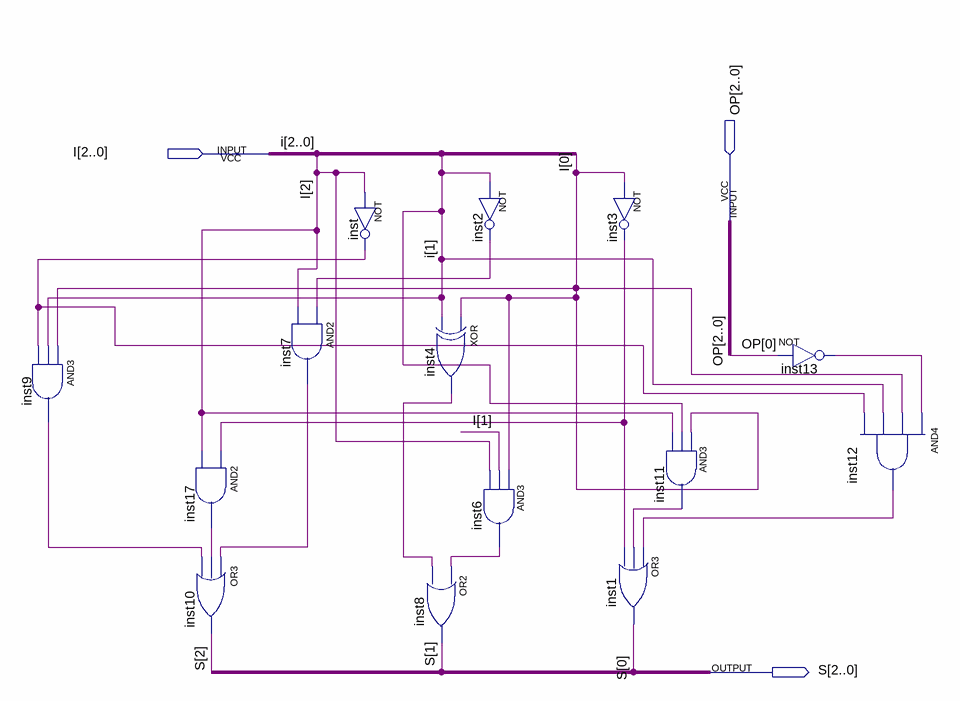
[diagram p0: schematic sheet]
// Quartus schematic State.bdf as structural Verilog: 14 symbols, 3 pins
module State (
  input  [2:0] I,
  input  [2:0] OP,
  output [2:0] S
);

  wire inst2_out, inst3_out, inst4_out, inst6_out, inst7_out, inst9_out, inst11_out, inst12_out, inst13_out,
       inst17_out, inst_out;

  and inst9 (inst9_out, I[0], I[1], inst_out);
  and inst17 (inst17_out, inst3_out, I[2]);
  or inst10 (S[2], inst7_out, inst17_out, inst9_out);
  and inst7 (inst7_out, inst2_out, I[2]);
  not inst (inst_out, I[2]);
  xor inst4 (inst4_out, I[0], I[1]);
  or inst8 (S[1], inst6_out, inst4_out);
  not inst2 (inst2_out, I[1]);
  and inst6 (inst6_out, I[0], I[1], I[2]);
  not inst3 (inst3_out, I[0]);
  and inst11 (inst11_out, I[0], I[1], I[2]);
  or inst1 (S[0], inst12_out, inst11_out, inst3_out);
  not inst13 (inst13_out, OP[0]);
  and inst12 (inst12_out, inst13_out, I[0], I[1], inst_out);
endmodule
